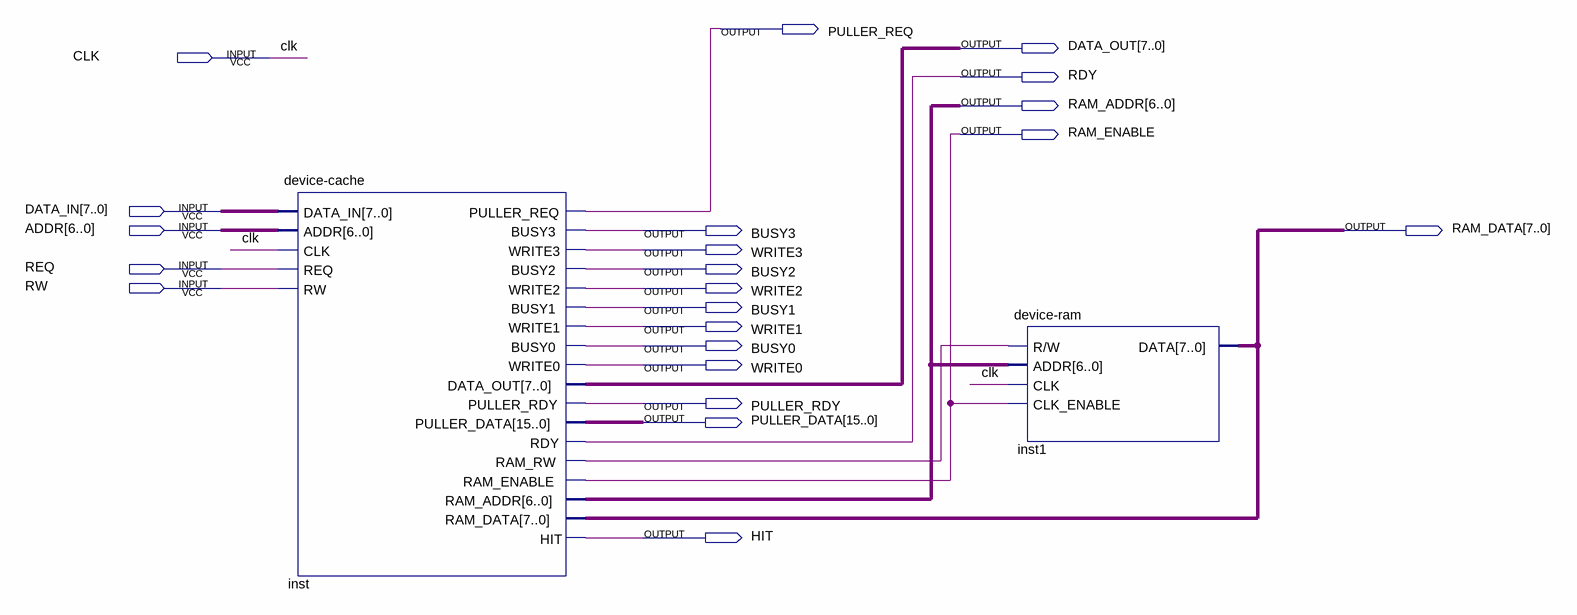
[diagram p0: schematic sheet]
// Quartus schematic device-cache-test.bdf as structural Verilog: 2 symbols, 22 pins
module \device-cache-test  (
  input  CLK,
  input  [7:0] DATA_IN,
  input  [6:0] ADDR,
  input  REQ,
  input  RW,
  output PULLER_REQ,
  output [7:0] DATA_OUT,
  output RDY,
  output [6:0] RAM_ADDR,
  output RAM_ENABLE,
  output BUSY3,
  output [7:0] RAM_DATA,
  output WRITE3,
  output BUSY2,
  output WRITE2,
  output BUSY1,
  output WRITE1,
  output BUSY0,
  output WRITE0,
  output PULLER_RDY,
  output [15:0] PULLER_DATA,
  output HIT
);

  wire inst_ram_rw;

  \device-cache  inst (
    .DATA_IN(DATA_IN), .ADDR(ADDR), .CLK(CLK), .REQ(REQ), .RW(RW), .PULLER_REQ(PULLER_REQ), .BUSY3(BUSY3),
    .WRITE3(WRITE3), .BUSY2(BUSY2), .WRITE2(WRITE2), .BUSY1(BUSY1), .WRITE1(WRITE1), .BUSY0(BUSY0),
    .WRITE0(WRITE0), .DATA_OUT(DATA_OUT), .PULLER_RDY(PULLER_RDY), .PULLER_DATA(PULLER_DATA), .RDY(RDY),
    .RAM_RW(inst_ram_rw), .RAM_ENABLE(RAM_ENABLE), .RAM_ADDR(RAM_ADDR), .HIT(HIT), .RAM_DATA(RAM_DATA));
  \device-ram  inst1 (.\R/W (inst_ram_rw), .ADDR(RAM_ADDR), .CLK(CLK), .CLK_ENABLE(RAM_ENABLE), .DATA(RAM_DATA));
endmodule
